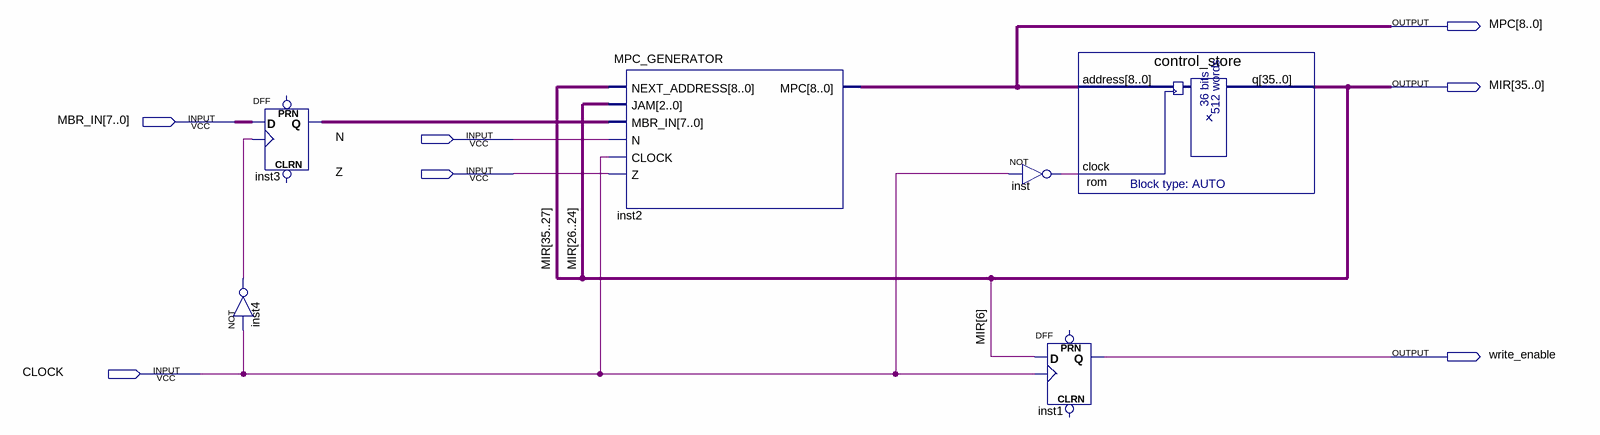
[diagram p0: schematic sheet]
// Quartus schematic CONTROL_UNIT.bdf as structural Verilog: 6 symbols, 7 pins
module CONTROL_UNIT (
  input  [7:0] MBR_IN,
  input  N,
  input  Z,
  input  CLOCK,
  output [8:0] MPC,
  output [35:0] MIR,
  output write_enable
);

  wire inst4_out, inst_out;
  wire [7:0] inst3_q;

  DFF inst3[7:0] (.CLK(inst4_out), .D(MBR_IN), .Q(inst3_q));  // open: CLRN, PRN
  not inst4 (inst4_out, CLOCK);
  MPC_GENERATOR inst2 (
    .NEXT_ADDRESS(MIR[35:27]), .JAM(MIR[26:24]), .MBR_IN(inst3_q), .N(N), .CLOCK(CLOCK), .Z(Z), .MPC(MPC));
  not inst (inst_out, CLOCK);
  DFF inst1 (.CLK(CLOCK), .D(MIR[6]), .Q(write_enable));  // open: CLRN, PRN
  control_store rom (.address(MPC), .clock(inst_out), .q(MIR));
endmodule
